# EAGLE design jack2jst (EAGLE 6.4)

## Sheet 1 of 2
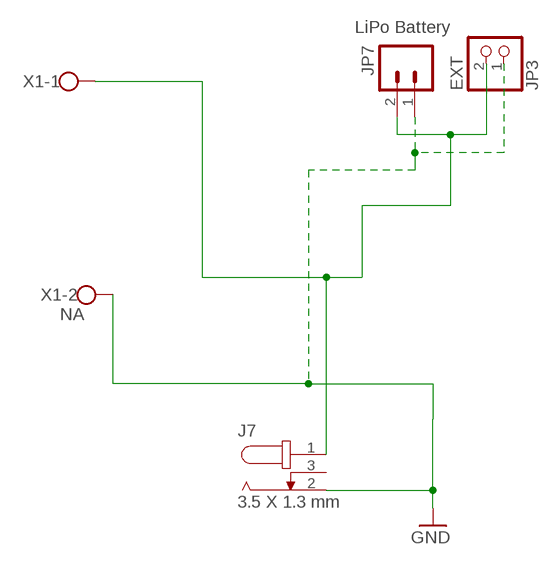
[diagram p0: schematic, sheet 1]

### Parts
J7  3.5 X 1.3 mm  DC_JACK_3.5X1.3MM  [3.5X1.3MM_DC_JACK]
JP3  EXT  PINHD-1X2  [1X02]
JP7  LiPo Battery  M02JST-PTH-2  [JST-2-PTH]
X1  NA  W237-102  [W237-102]

### Nets
GND [GND]: J7.2 JP3.1 JP7.1 X1.2
VCCEXT [VCC]: J7.1 JP3.2 JP7.2 X1.1
Unconnected: J7.3

## Sheet 2 of 2

## Library data of the parts
J7 = MY_CONN:DC_JACK_3.5X1.3MM
JP3 = pinhead:PINHD-1X2: PIN HEADER
JP7 = SparkFun:M02: Header 2 Standard 2-pin 0.1" header. Use with straight break away headers (SKU : PRT-00116), right angle break away headers (PRT-00553), swiss pins (PRT-00743), machine pins (PRT-00117), and female headers (PRT-00115). Molex polarized connector foot print use with SKU : PRT-08233 with associated crimp pins and housings.
X1 = con-wago-500:W237-102: WAGO SCREW CLAMP

## Net classes
1 GND: width 0.762 mm, drill 0.508 mm, clearance 0.254 mm
2 VCC: width 0.762 mm, drill 0.508 mm, clearance 0.254 mm

## Board
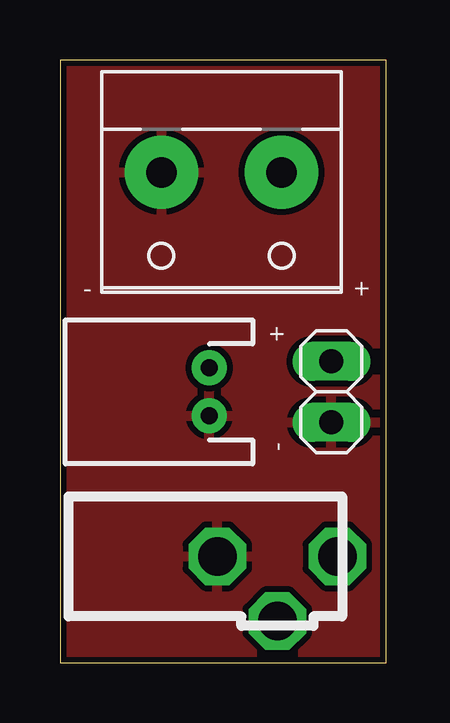
[diagram p1: board, top side]
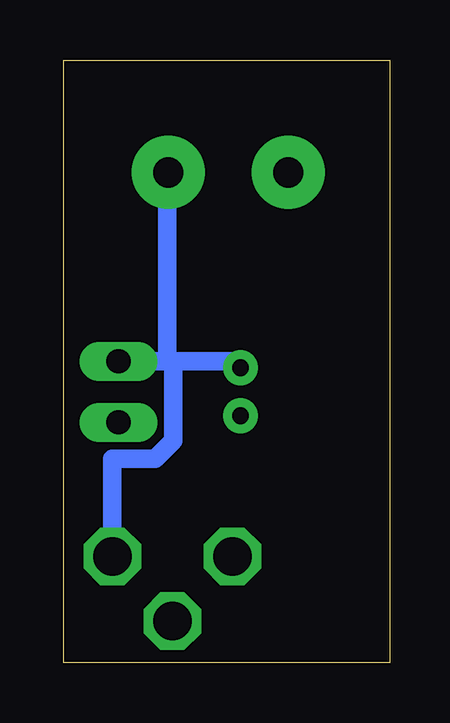
[diagram p2: board, bottom side, seen from below]

Size 13.59 x 25.11 mm. Coordinates in mm from the lower left corner, seen from the top.
Outline: 0,0 13.59,0 13.59,25.11 0,25.11 0,0
Copper layers (1*16): Top 0.035mm / dielectric 1.5mm / Bottom 0.035mm
Design rules "SparkFun *": minimum track width 25mil, minimum drill 20mil, track to track 8mil, track to pad 8mil, pad to pad 8mil, via to via 8mil, smd to smd 8mil, copper to edge 10mil, drill to drill 8mil, minimum pad ring 12mil, minimum via ring 10mil, stop-mask expansion 4mil, vias tented up to drill 25mil, thermal gap 10mil

### Footprints (pad centres in the part's own frame; a part is rotated, then mirrored left to right if it is on the bottom)
3.5X1.3MM_DC_JACK = drill 1.6 octagon: 1 0,0; 2 -5,0; 3 -2.5,-2.7
1X02 = drill 1.016 long: 1 -1.27,0; 2 1.27,0
JST-2-PTH = drill 0.7 pad 1.448: 1 -1,0; 2 1,0
W237-102 = drill 1.27 pad 3.048: 1 -2.5,-1.27; 2 2.5,-1.27

### Placement (x,y rotation side)
J7  11.56,4.43 0 top
JP3  11.3,11.28 90 top
JP7  6.22,11.28 90 top
X1  6.73,19.16 180 top

### Tracks (layer width: path | path; a pad name or v marks a point on that pad's centre or on a via)
GND
  pour Top: -0.76,25.25 14.22,25.25 14.22,-0.4 -0.76,-0.4
VCCEXT
  Bottom 0.762: JP3.2 9.27,12.55 | 9.27,12.55 9.02,12.55 | 9.02,12.55 6.48,12.55 6.22,12.3 JP7.2 | J7.1 11.56,8.49 9.78,8.49 9.02,9.25 9.02,12.3 9.02,12.55 | X1.1 9.27,20.43 9.27,12.81 9.27,12.55

### Text on the board
tNames: - | + | + | -